# Altium schematic sheet СФ МЭИ ЛБ ПЭ2-18 11.03.04 03 Э3.SchDoc
size 420 x 297 mm; Scale: 1:1; Разраб.: Саленков В.А.; Пров.: Смолин В.А.; Номер листа: 1; Общее количество листов: 1; Наименование изделия 1: Стабилизатор напряжения; Наименование изделия 2: Схема электрическая; Наименование изделия 3: принципиальная; Нач. отд.: Нач. отд.; Децимальный номер: СФ МЭИ ЛБ ПЭ2-18 11.03.04 09 Э3; Наименование. Строка 2: синусоидальных сигналов; Наименование. Строка 3: Схема электирическая принципиальная; Наименование. Строка 1: Генератор; Разработал: Саленков В.А.; Проверил: Смолин В.А.; Утвердил: Рассказа Д.С.; Литера: У; Масштаб: 1:1; Лист. Номер: 1; Лист. Всего: 1
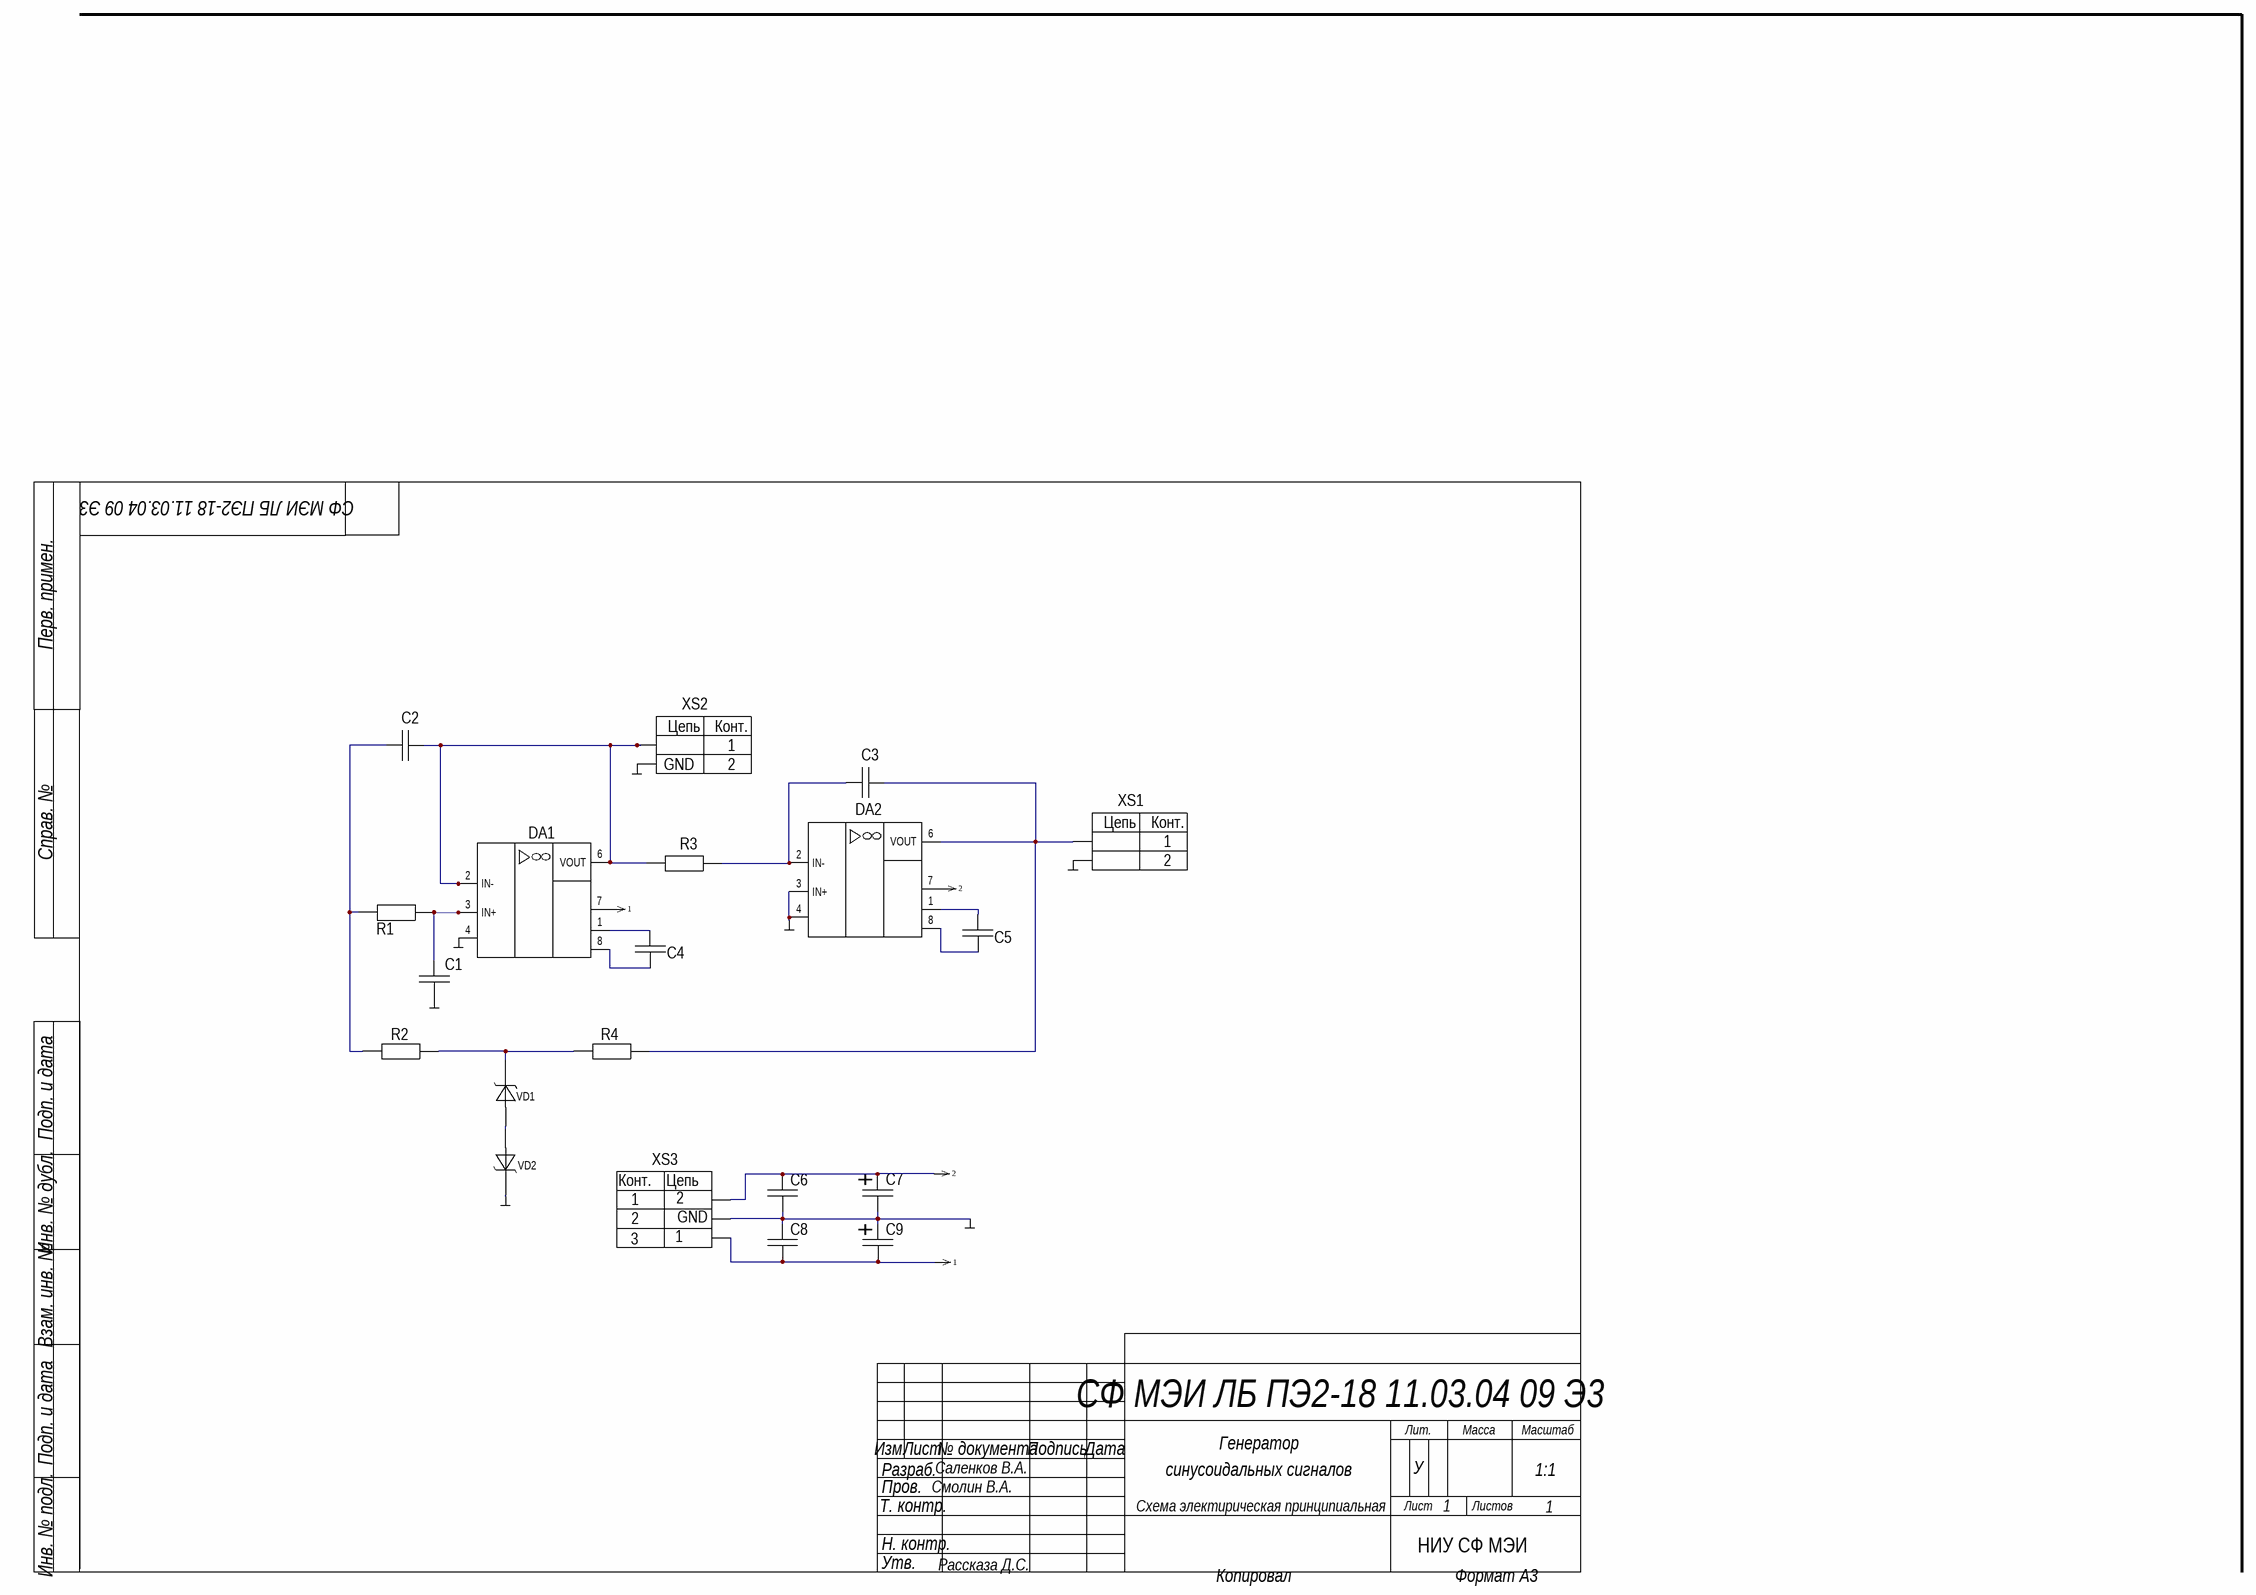
[diagram p0: СФ МЭИ ЛБ ПЭ2-18 11.03.04 03 Э3.SchDoc]

## Parts
C1  0.047u  [0805]  (value not drawn)
C2  1000  [0805]  (value not drawn)
C3  1000  [0805]  (value not drawn)
C4  0.068u  [0805]  (value not drawn)
C5  0.068u  [0805]  (value not drawn)
C6  0.068u  [0805]  (value not drawn)
C7  1000  [ECAP SMD, 1 мкФ, 50В, Конденсатор электролитический алюминиевый SMD]  (value not drawn)
C8  0.068u  [0805]  (value not drawn)
C9  1000  [ECAP SMD, 1 мкФ, 50В, Конденсатор электролитический алюминиевый SMD]  (value not drawn)
DA1  КФ140УД18  [SOIC-8]  (value not drawn)
DA2  КФ140УД18  [SOIC-8]  (value not drawn)
R1  7,5k  [0805]  (value not drawn)
R2  18k  [0805]  (value not drawn)
R3  18k  [0805]  (value not drawn)
R4  18k  [0805]  (value not drawn)
VD1  MMSZ5235B  [SOD-123]  (value not drawn)
VD2  MMSZ5235B  [SOD-123]  (value not drawn)
XS1  DG126-5.0-0.2P  [DG126-5.0-02P]  (value not drawn)
XS2  DG126-5.0-0.2P  [DG126-5.0-02P]  (value not drawn)
XS3  DG126-5.0-0.3P  [CI1108M1H - duplicate]  (value not drawn)

## Nets
1: C8.1 C9.1 DA1.7 XS3.3(Pin3)
2: C6.2 C7.2 DA2.7 XS3.1(Pin1)
NetC1_1: C1.1 C6.1 C7.1 C8.2 C9.2 DA1.4 DA2.3(IN+) DA2.4 VD2.2(Out) XS1.2(Pin2) XS2.2(Pin2) XS3.2(Pin2)
NetC1_2: C1.2 DA1.3(IN+) R1.1
NetC2_1: C2.1 DA1.2(IN-) DA1.6(VOUT) R3.2 XS2.1(Pin1)
NetC2_2: C2.2 R1.2 R2.2
NetC3_1: C3.1 DA2.6(VOUT) R4.1 XS1.1(Pin1)
NetC3_2: C3.2 DA2.2(IN-) R3.1
NetC4_1: C4.1 DA1.8
NetC4_2: C4.2 DA1.1
NetC5_1: C5.1 DA2.8
NetC5_2: C5.2 DA2.1
NetR2_1: R2.1 R4.2 VD1.2(Out)
NetVD1_1: VD1.1(In) VD2.1(In)

## Notes on the sheet
- (near XS2) GND
- (near XS3) 2
- (near XS3) GND
- (near XS3) 1
- НИУ СФ МЭИ ПЭ2-18
- Перв. примен.
- Справ. №
- Подп. и дата
- Инв. № дубл.
- Взам. инв. №
- Разраб.
- Изм.
- Лист
- № документа
- Подпись
- Дата
- Лит.
- Масса
- Масштаб
- Т. контр.
- Пров.
- Листов
- Инв. № подл.
- Н. контр.
- Утв.
- Копировал
- Формат A3
- (in symbol DG126-5.0-0.2P) Цепь; Конт.
- (in symbol DG126-5.0-0.3P) Конт.; Цепь
- (in symbol SMD Конденсатор полярный) +

## Library data of the parts
C1 = К53-68"R"-25В-0.047 мкФ ±10% 0805_3: К53-68"R"-25В-0.01 мкФ ±1%
C2 C3 = К53-68"R"-25В-1000 пФ ±10% 0805_2: К53-68"R"-25В-0,02 мкФ±1%
C4 C5 = К53-68"R"-25В-0.068 мкФ ±10% 0805: К53-68"R"-25В-30 пФ ±10%
C6 C8 = К53-68"R"-25В-0.068 мкФ ±10% 0805: К53-68"R"-25В-0.1 мкФ ±10%
C7 C9 = SMD Конденсатор полярный: ECAP SMD-16 В-470 мкФ±10%
DA1 DA2 = КФ140УД18: LM100
R1 = 0.125Вт 0805 7,5 кОм, 5%, Чип резистор (SMD): 0805-0.125 Вт -22 мОм±1%
R2 = 0.125Вт 0805 18 кОм, 5%, Чип резистор (SMD): 0805-0.125 Вт -22 мОм±1%
R3 = 0.125Вт 0805 18 кОм, 5%, Чип резистор (SMD): 0805-0.125 Вт -10 мОм±5%
R4 = 0.125Вт 0805 18 кОм, 5%, Чип резистор (SMD): 0805-0.125 Вт -50 кОм±5%
VD1 VD2 = MMSZ5235B: BZV55C27
XS3 = DG126-5.0-0.3P: DG126-5.0-0.2P